# Altium project MiniRobot.PrjPcb
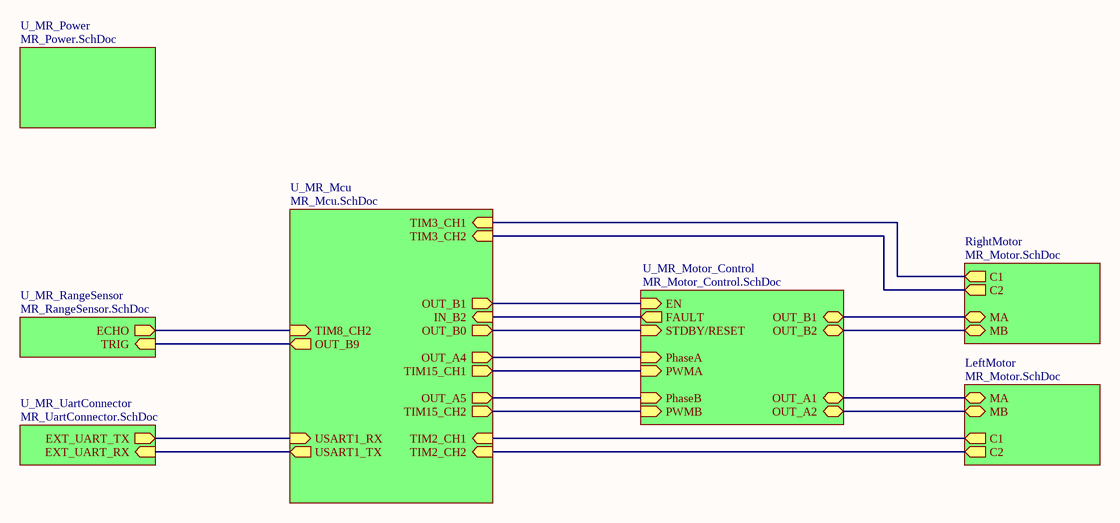
[diagram p0: MR_main.SchDoc]
6 sheets, 33 parts. Net scope: hierarchical (ports join the sheet entries above them; power ports are global).
Board file: MiniRobot.PcbDoc
Sheets:
  MR_main.SchDoc
    U_MR_Motor_Control = MR_Motor_Control.SchDoc
    U_MR_Power = MR_Power.SchDoc
    RightMotor = MR_Motor.SchDoc
    LeftMotor = MR_Motor.SchDoc
    U_MR_RangeSensor = MR_RangeSensor.SchDoc
    U_MR_UartConnector = MR_UartConnector.SchDoc

## Sheet MR_main.SchDoc
size A4; CompanyName: BeeIonic; SheetNumber: 1; SheetTotal: 7

### Sub-sheets
LeftMotor = MR_Motor.SchDoc: MA (bidir), C1 (out), C2 (out), MB (bidir)
RightMotor = MR_Motor.SchDoc: MA (bidir), C1 (out), C2 (out), MB (bidir)
U_MR_Mcu = MR_Mcu.SchDoc (file not in this document): TIM15_CH2 (out), TIM2_CH1 (in), TIM3_CH2 (in), TIM2_CH2 (in), USART1_RX (in), TIM15_CH1 (out), TIM3_CH1 (in), USART1_TX (out), OUT_B1 (out), OUT_A4 (out), OUT_A5 (out), IN_B2 (in), OUT_B0 (out), TIM8_CH2 (in), OUT_B9 (out)
U_MR_Motor_Control = MR_Motor_Control.SchDoc: OUT_A1 (bidir), PWMB (in), OUT_B1 (bidir), OUT_A2 (bidir), OUT_B2 (bidir), FAULT (out), PhaseA (in), PhaseB (in), STDBY/RESET (in), EN (in), PWMA (in)
U_MR_Power = MR_Power.SchDoc: no entries
U_MR_RangeSensor = MR_RangeSensor.SchDoc: ECHO (out), TRIG (in)
U_MR_UartConnector = MR_UartConnector.SchDoc: EXT_UART_RX (in), EXT_UART_TX (out)

### Nets
NetC3_2: sheet U_MR_Mcu/IN_B2, sheet U_MR_Motor_Control/FAULT
NetCstby_2: sheet U_MR_Mcu/OUT_B0, sheet U_MR_Motor_Control/STDBY/RESET
NetH4_4: sheet U_MR_Mcu/USART1_TX, sheet U_MR_UartConnector/EXT_UART_RX
NetH6_1_1: sheet U_MR_Motor_Control/OUT_A1, sheet LeftMotor/MA
NetH6_1_5: sheet U_MR_Motor_Control/OUT_A2, sheet LeftMotor/MB
NetH6_2_1: sheet U_MR_Motor_Control/OUT_B1, sheet RightMotor/MA
NetH6_2_5: sheet U_MR_Motor_Control/OUT_B2, sheet RightMotor/MB
NetM_3: sheet U_MR_Mcu/OUT_B9, sheet U_MR_RangeSensor/TRIG
NetR1_1_1: sheet U_MR_Mcu/TIM2_CH1, sheet LeftMotor/C1
NetR1_2_1: sheet U_MR_Mcu/TIM3_CH1, sheet RightMotor/C1
NetR2_1_1: sheet U_MR_Mcu/TIM2_CH2, sheet LeftMotor/C2
NetR2_2_1: sheet U_MR_Mcu/TIM3_CH2, sheet RightMotor/C2
NetR3_1: sheet U_MR_Mcu/OUT_B1, sheet U_MR_Motor_Control/EN
NetR12_1: sheet U_MR_Mcu/USART1_RX, sheet U_MR_UartConnector/EXT_UART_TX
NetR20_1: sheet U_MR_Mcu/TIM8_CH2, sheet U_MR_RangeSensor/ECHO
NetU_1: sheet U_MR_Mcu/OUT_A4, sheet U_MR_Motor_Control/PhaseA
NetU_2: sheet U_MR_Mcu/TIM15_CH1, sheet U_MR_Motor_Control/PWMA
NetU_15: sheet U_MR_Mcu/OUT_A5, sheet U_MR_Motor_Control/PhaseB
NetU_16: sheet U_MR_Mcu/TIM15_CH2, sheet U_MR_Motor_Control/PWMB

### Notes on the sheet
- Project :
- Title :
- Sheet:
- of
- Creation Date :
- Designer :
- Modified Date :

## Sheet MR_Motor_Control.SchDoc
size A4; CompanyName: BeeIonic; SheetNumber: 3; SheetTotal: 7
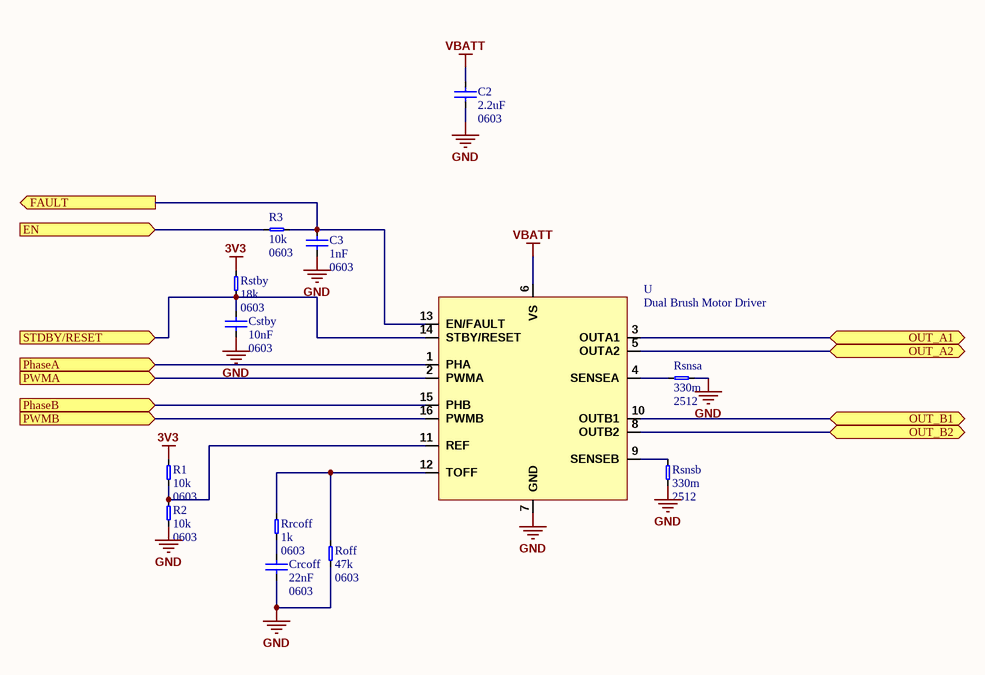
[diagram p1: MR_Motor_Control.SchDoc]

### Parts
C2  value 2.2uF  Package: 0603  [0603_CAP_LD]  (hidden comment: CerCap)
C3  value 1nF  Package: 0603  [0603_CAP_LD]  (hidden comment: CerCap)
Crcoff  value 22nF  Package: 0603  [0603_CAP_LD]  (hidden comment: CerCap)
Cstby  value 10nF  Package: 0603  [0603_CAP_LD]  (hidden comment: CerCap)
R1  value 10k  Package: 0603  [0603_RES_LD]  (hidden comment: Resistor)
R2  value 10k  Package: 0603  [0603_RES_LD]  (hidden comment: Resistor)
R3  value 10k  Package: 0603  [0603_RES_LD]  (hidden comment: Resistor)
Roff  value 47k  Package: 0603  [0603_RES_LD]  (hidden comment: Resistor)
Rrcoff  value 1k  Package: 0603  [0603_RES_LD]  (hidden comment: Resistor)
Rsnsa  value 330m  Package: 2512  [2512_RES_LD]  (hidden comment: Resistor)
Rsnsb  value 330m  Package: 2512  [2512_RES_LD]  (hidden comment: Resistor)
Rstby  value 18k  Package: 0603  [0603_RES_LD]  (hidden comment: Resistor)
U  Dual Brush Motor Driver  [QFN-STSPIN240]

### Ports
EN (in), FAULT (out), OUT_A1 (bidir), OUT_A2 (bidir), OUT_B1 (bidir), OUT_B2 (bidir), PhaseA (in), PhaseB (in), PWMA (in), PWMB (in), STDBY/RESET (in)

### Nets
3V3: R1.2 Rstby.2
GND: C2.1 C3.1 Crcoff.1 Cstby.1 R2.1 Roff.1 Rsnsa.1 Rsnsb.1 U.7(GND)
VBATT: C2.2 U.6(VS)
NetC3_2: C3.2 R3.2 U.13(EN/FAULT) ; port FAULT
NetCrcoff_2: Crcoff.2 Rrcoff.1
NetCstby_2: Cstby.2 Rstby.1 U.14(STBY/RESET) ; port STDBY/RESET
NetH6_1_1: U.3(OUTA1) ; port OUT_A1
NetH6_1_5: U.5(OUTA2) ; port OUT_A2
NetH6_2_1: U.10(OUTB1) ; port OUT_B1
NetH6_2_5: U.8(OUTB2) ; port OUT_B2
NetR1_1: R1.1 R2.2 U.11(REF)
NetR3_1: R3.1 ; port EN
NetRoff_2: Roff.2 Rrcoff.2 U.12(TOFF)
NetRsnsa_2: Rsnsa.2 U.4(SENSEA)
NetRsnsb_2: Rsnsb.2 U.9(SENSEB)
NetU_1: U.1(PHA) ; port PhaseA
NetU_2: U.2(PWMA) ; port PWMA
NetU_15: U.15(PHB) ; port PhaseB
NetU_16: U.16(PWMB) ; port PWMB

### Notes on the sheet
- Project :
- Title :
- Sheet:
- of
- Creation Date :
- Designer :
- Modified Date :

### Library data of the parts
C2 C3 Crcoff Cstby = CerCap: Ceramic Capacitor; Type: *; Voltage/Power: *
U = STSPIN240: ST Dual Motor Driver
R1-R3 Roff Rrcoff Rsnsa Rsnsb Rstby = Resistor: Precision: *

## Sheet MR_Power.SchDoc
size A4; CompanyName: BeeIonic; SheetNumber: 5; SheetTotal: 7
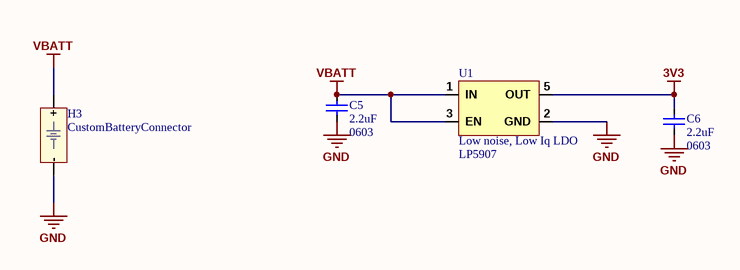
[diagram p2: MR_Power.SchDoc]

### Parts
C5  value 2.2uF  Package: 0603  [0603_CAP_LD]  (hidden comment: CerCap)
C6  value 2.2uF  Package: 0603  [0603_CAP_LD]  (hidden comment: CerCap)
H3  CustomBatteryConnector  [CustomBatteryConnector]
U1  Low noise, Low Iq LDO  [LP5907]

### Nets
3V3: C6.2 U1.5(OUT)
GND: C5.1 C6.1 H3.- U1.2(GND)
VBATT: C5.2 H3.+ U1.1(IN) U1.3(EN)

Not connected (* = marked no-connect by the designer): U1 4(NC)

### Notes on the sheet
- Project :
- Title :
- Sheet:
- of
- Creation Date :
- Designer :
- Modified Date :

### Library data of the parts
C5 C6 = CerCap: Ceramic Capacitor; Type: *; Voltage/Power: *
H3 = BatteryConnector: Custom Battery Connector
U1 = LP5907: LP5907 Low Noise Low Iq LDO; Reference: LP5907

## Sheet MR_Motor.SchDoc
size A4; CompanyName: BeeIonic; SheetNumber: 2; SheetTotal: 7
Used 2 times, as channels RightMotor, LeftMotor. Parts and nets are listed once, with the designators drawn on the sheet.
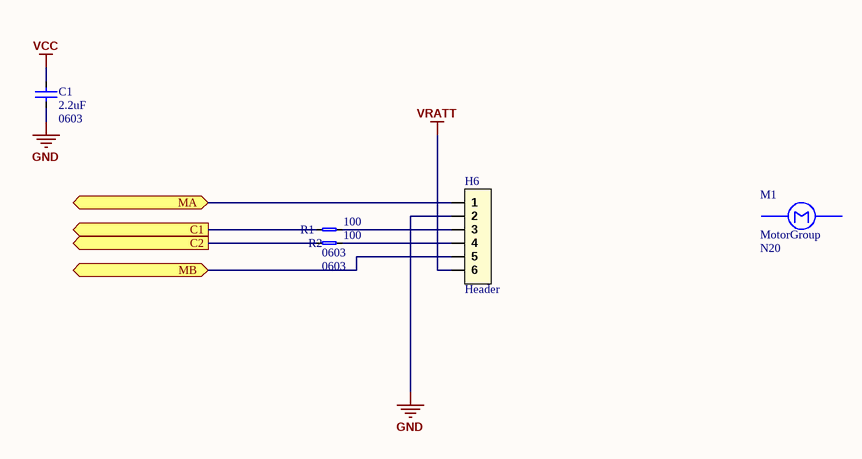
[diagram p3: MR_Motor.SchDoc]

### Parts
C1  value 2.2uF  Package: 0603  [0603_CAP_LD]  (hidden comment: CerCap)
H6  Header  [HEADER_1X6_PICOBLADE_653106124022]
M1  MotorGroup  Reference: N20  [MotorGroup]
R1  value 100  Package: 0603  [0603_RES_LD]  (hidden comment: Resistor)
R2  value 100  Package: 0603  [0603_RES_LD]  (hidden comment: Resistor)

### Ports
C1 (out), C2 (out), MA (bidir), MB (bidir)

### Nets
GND: C1.1 H6.2
VCC: C1.2
VRATT: H6.6
C1: R1.1 ; port C1
C2: R2.1 ; port C2
MA: H6.1 ; port MA
MB: H6.5 ; port MB
NetH6_3: H6.3 R1.2
NetH6_4: H6.4 R2.2

### Channels
RightMotor: designators end in _2; ports C1=NetR1_2_1 C2=NetR2_2_1 MA=NetH6_2_1 MB=NetH6_2_5
LeftMotor: designators end in _1; ports C1=NetR1_1_1 C2=NetR2_1_1 MA=NetH6_1_1 MB=NetH6_1_5

### Notes on the sheet
- Project :
- Title :
- Sheet:
- of
- Creation Date :
- Designer :
- Modified Date :

### Library data of the parts
C1 = CerCap: Ceramic Capacitor; Type: *; Voltage/Power: *
H6 = Header_6x1: Header 6x1 Pins
M1 = Motor
R1 R2 = Resistor: Precision: *

## Sheet MR_RangeSensor.SchDoc
size A4; CompanyName: BeeIonic; SheetNumber: 6; SheetTotal: 7
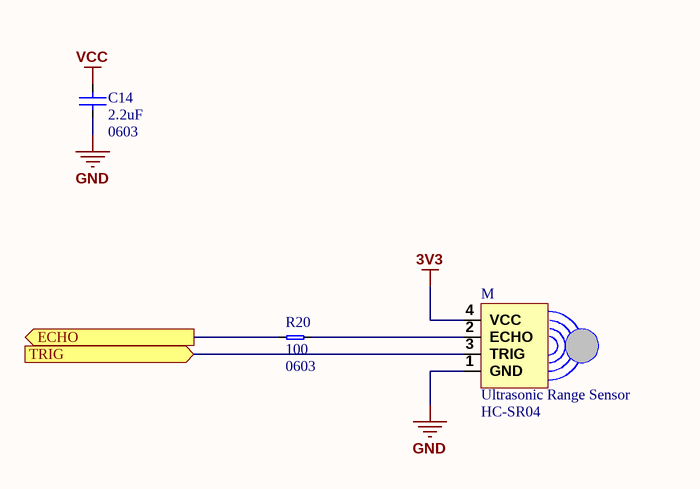
[diagram p4: MR_RangeSensor.SchDoc]

### Parts
C14  value 2.2uF  Package: 0603  [0603_CAP_LD]  (hidden comment: CerCap)
M  Ultrasonic Range Sensor  [HC-SR04]
R20  value 100  Package: 0603  [0603_RES_LD]  (hidden comment: Resistor)

### Ports
ECHO (out), TRIG (in)

### Nets
3V3: M.4(VCC)
GND: C14.1 M.1(GND)
VCC: C14.2
NetM_2: M.2(ECHO) R20.2
NetM_3: M.3(TRIG) ; port TRIG
NetR20_1: R20.1 ; port ECHO

### Notes on the sheet
- Project :
- Title :
- Sheet:
- of
- Creation Date :
- Designer :
- Modified Date :

### Library data of the parts
C14 = CerCap: Ceramic Capacitor; Type: *; Voltage/Power: *
M = HC-SR04: Reference: HC-SR04
R20 = Resistor: Precision: *

## Sheet MR_UartConnector.SchDoc
size A4; CompanyName: BeeIonic; SheetNumber: 7; SheetTotal: 7
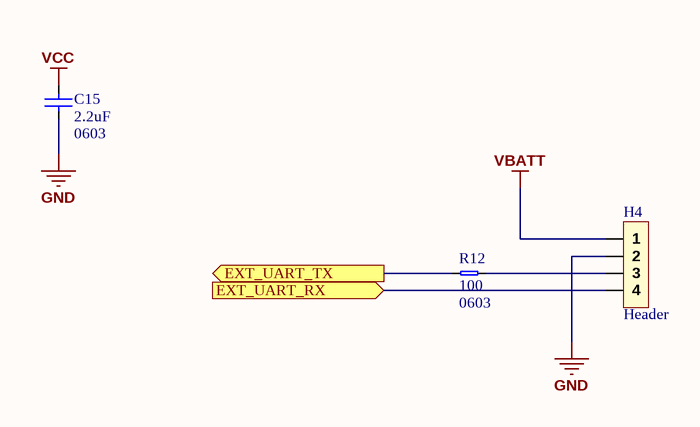
[diagram p5: MR_UartConnector.SchDoc]

### Parts
C15  value 2.2uF  Package: 0603  [0603_CAP_LD]  (hidden comment: CerCap)
H4  Header  [HE14 1x4 Straight]
R12  value 100  Package: 0603  [0603_RES_LD]  (hidden comment: Resistor)

### Ports
EXT_UART_RX (in), EXT_UART_TX (out)

### Nets
GND: C15.1 H4.2
VBATT: H4.1
VCC: C15.2
NetH4_3: H4.3 R12.2
NetH4_4: H4.4 ; port EXT_UART_RX
NetR12_1: R12.1 ; port EXT_UART_TX

### Notes on the sheet
- Project :
- Title :
- Sheet:
- of
- Creation Date :
- Designer :
- Modified Date :

### Library data of the parts
C15 = CerCap: Ceramic Capacitor; Type: *; Voltage/Power: *
H4 = Header_4x1: Header 4x1 PIns
R12 = Resistor: Precision: *

## Nets that join several sheets
3V3: MR_Motor_Control (R1.2 Rstby.2), MR_Power (C6.2 U1.5), MR_RangeSensor (M.4)
GND: MR_Motor_Control (9 pins), MR_Power (C5.1 C6.1 H3.- U1.2), RightMotor (C1_2.1 H6_2.2), LeftMotor (C1_1.1 H6_1.2), MR_RangeSensor (C14.1 M.1), MR_UartConnector (C15.1 H4.2)
VBATT: MR_Motor_Control (C2.2 U.6), MR_Power (C5.2 H3.+ U1.1 U1.3), MR_UartConnector (H4.1)
VCC: RightMotor (C1_2.2), LeftMotor (C1_1.2), MR_RangeSensor (C14.2), MR_UartConnector (C15.2)
VRATT: RightMotor (H6_2.6), LeftMotor (H6_1.6)
NetH6_1_1: MR_Motor_Control (U.3), LeftMotor (H6_1.1)
NetH6_1_5: MR_Motor_Control (U.5), LeftMotor (H6_1.5)
NetH6_2_1: MR_Motor_Control (U.10), RightMotor (H6_2.1)
NetH6_2_5: MR_Motor_Control (U.8), RightMotor (H6_2.5)